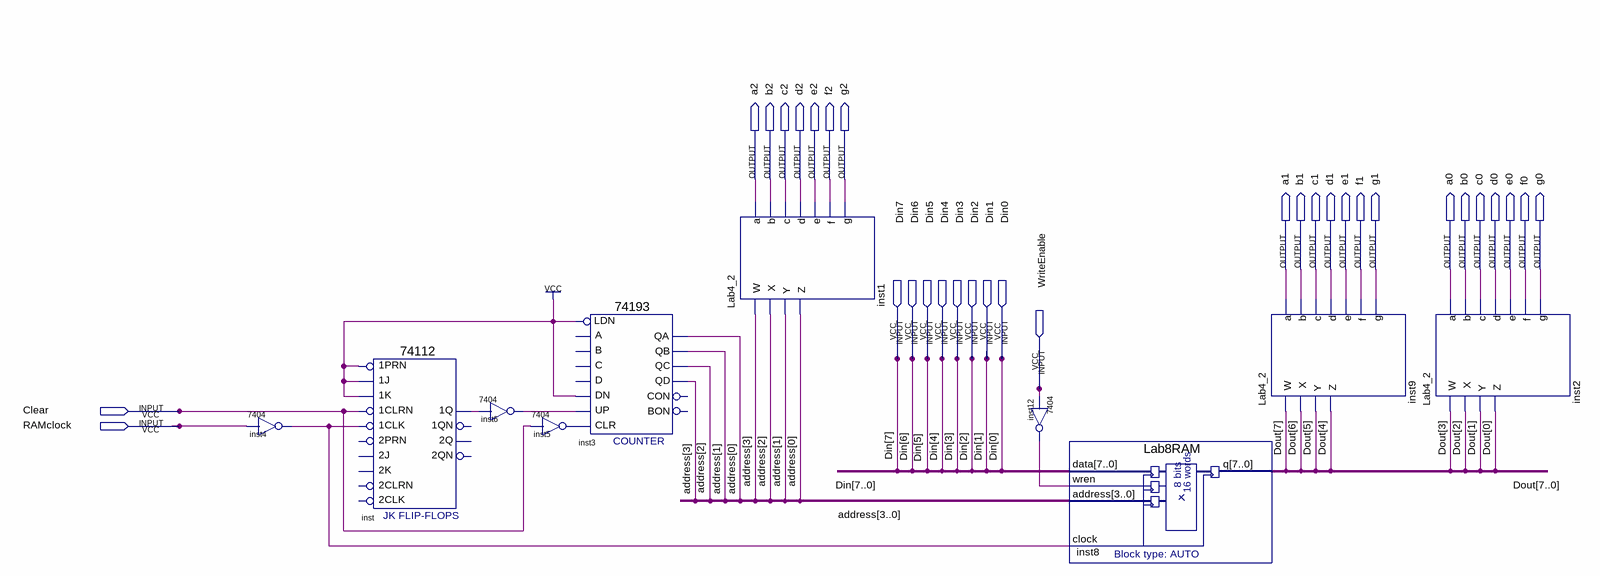
[diagram p0: schematic sheet]
// Quartus schematic Lab8.bdf as structural Verilog: 10 symbols, 32 pins
module Lab8 (
  input  Din7,
  input  Din6,
  input  Din5,
  input  Din4,
  input  Din3,
  input  Din2,
  input  Din1,
  input  Din0,
  input  WriteEnable,
  input  Clear,
  input  RAMclock,
  output a2,
  output b2,
  output c2,
  output d2,
  output e2,
  output f2,
  output g2,
  output a1,
  output b1,
  output c1,
  output d1,
  output e1,
  output f1,
  output g1,
  output a0,
  output b0,
  output c0,
  output d0,
  output e0,
  output f0,
  output g0
);

  wire inst4_1, inst5_1, inst6_1, inst12_1, inst_1q;
  wire [3:0] address;
  wire [7:0] Dout;

  \7404  inst4 (.\2 (RAMclock), .\1 (inst4_1));
  \74112  inst (
    .\1K (1'b1), .\1J (1'b1), .\1PRN (1'b1), .\1CLK (inst4_1), .\1CLRN (Clear), .\1Q (inst_1q));  // open: 2K, 2J, 2PRN, 2CLK, 2CLRN, 1QN, 2Q, 2QN
  \7404  inst6 (.\2 (inst_1q), .\1 (inst6_1));
  \7404  inst5 (.\2 (Clear), .\1 (inst5_1));
  \74193  inst3 (
    .CLR(inst5_1), .UP(inst6_1), .DN(1'b1), .LDN(1'b1), .QB(address[1]), .QA(address[0]), .QD(address[3]),
    .QC(address[2]));  // open: D, C, B, A, CON, BON
  Lab4_2 inst1 (
    .W(address[3]), .X(address[2]), .Y(address[1]), .Z(address[0]), .a(a2), .b(b2), .c(c2), .d(d2), .e(e2),
    .f(f2), .g(g2));
  \7404  inst12 (.\2 (WriteEnable), .\1 (inst12_1));
  Lab8RAM inst8 (
    .data({Din7, Din6, Din5, Din4, Din3, Din2, Din1, Din0}), .wren(inst12_1), .address(address),
    .clock(inst4_1), .q(Dout));
  Lab4_2 inst9 (
    .W(Dout[7]), .X(Dout[6]), .Y(Dout[5]), .Z(Dout[4]), .a(a1), .b(b1), .c(c1), .d(d1), .e(e1), .f(f1), .g(g1));
  Lab4_2 inst2 (
    .W(Dout[3]), .X(Dout[2]), .Y(Dout[1]), .Z(Dout[0]), .a(a0), .b(b0), .c(c0), .d(d0), .e(e0), .f(f0), .g(g0));
endmodule
